# EAGLE design remote_switch (EAGLE 6.4)
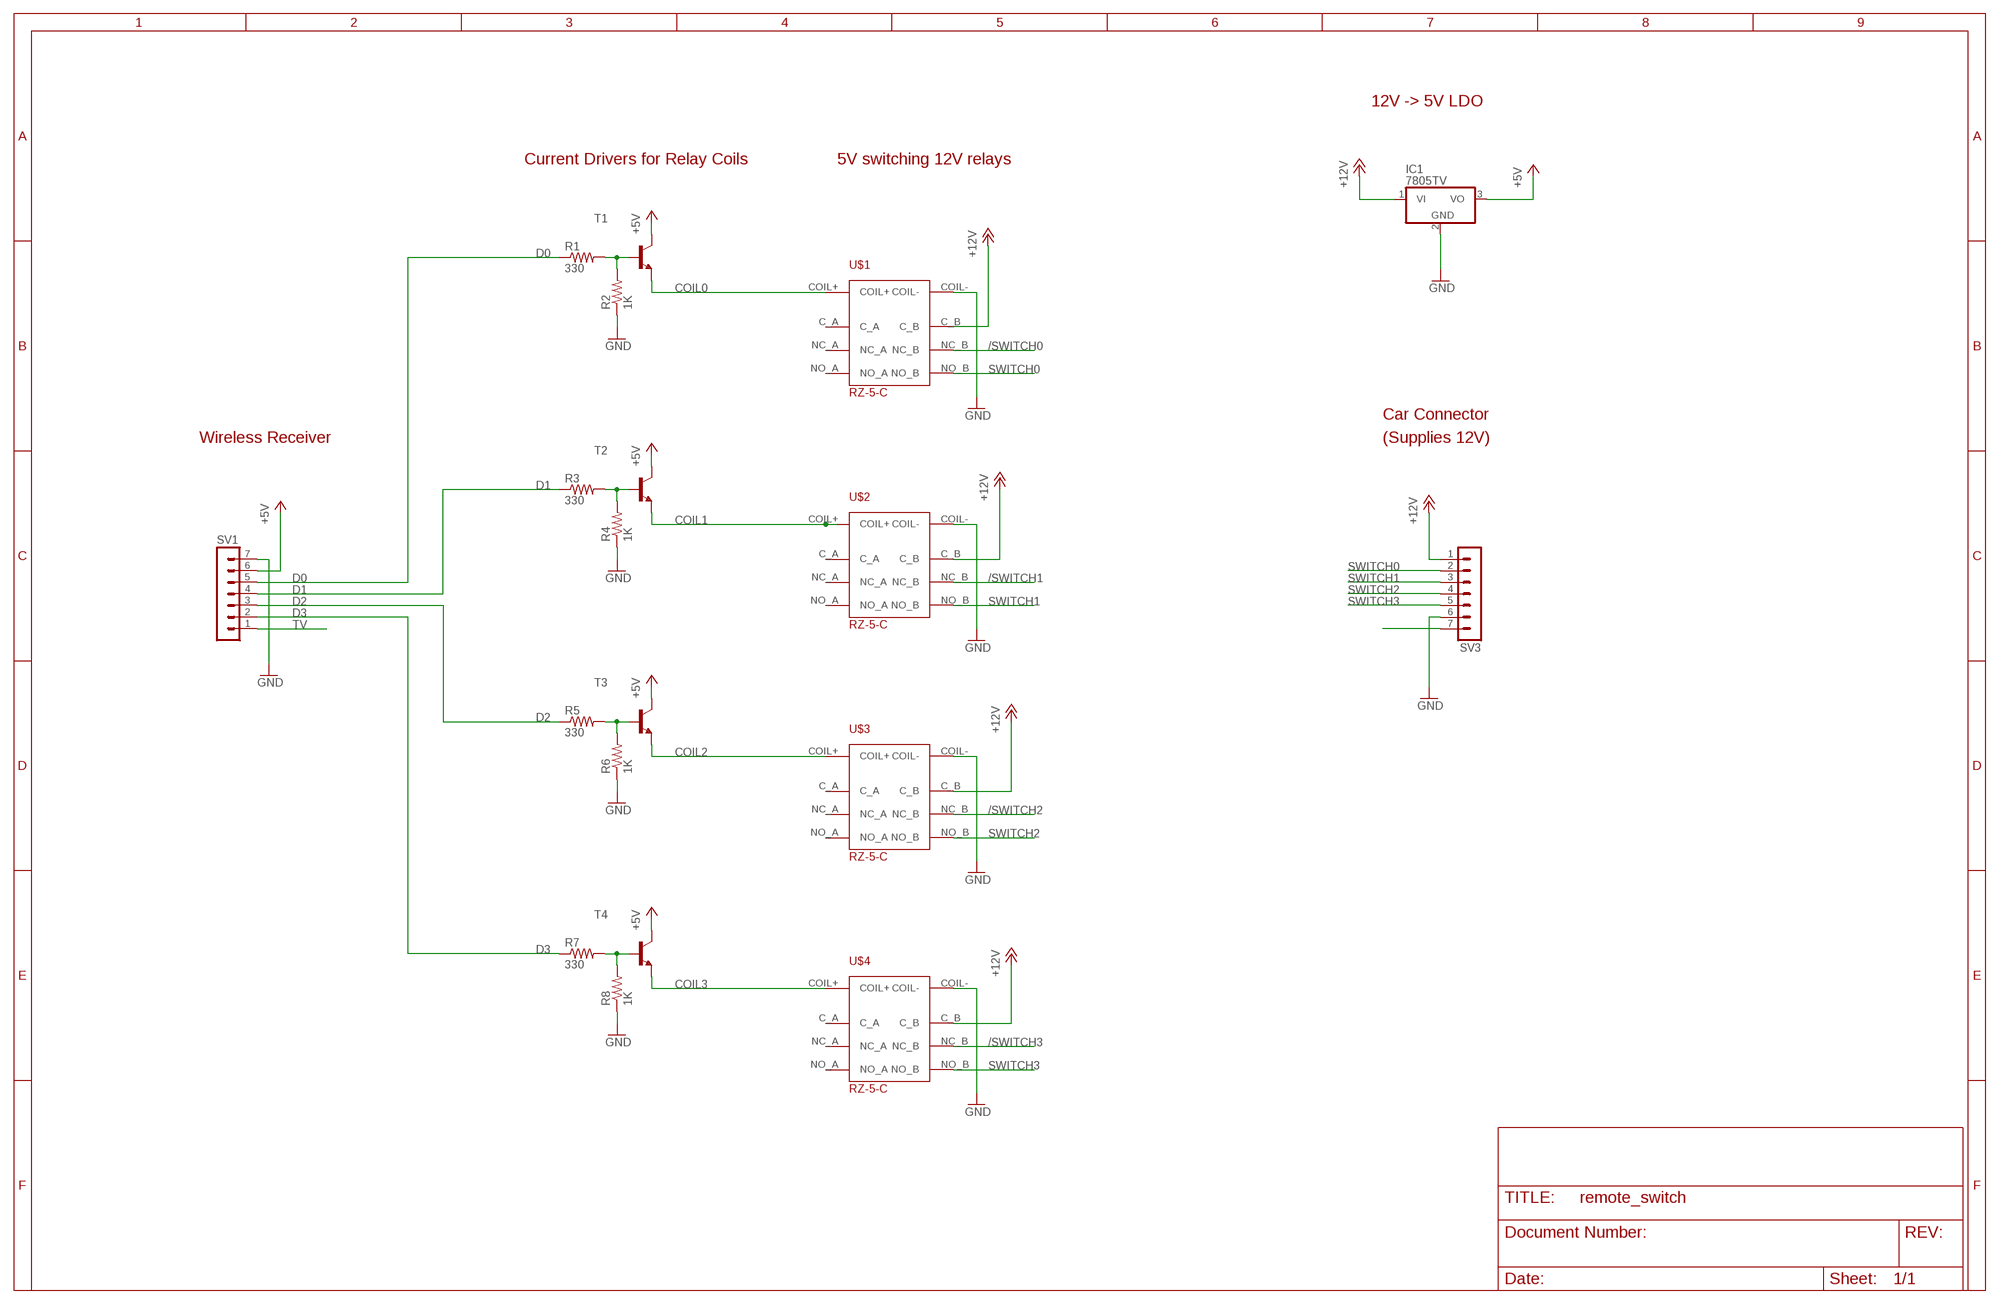
[diagram p0: schematic, sheet 1]

## Parts
IC1  7805TV  [TO220V]
R1  330  R-US_0613/5V  [P0613V]
R2  1K  R-US_0613/5V  [P0613V]
R3  330  R-US_0613/5V  [P0613V]
R4  1K  R-US_0613/5V  [P0613V]
R5  330  R-US_0613/5V  [P0613V]
R6  1K  R-US_0613/5V  [P0613V]
R7  330  R-US_0613/5V  [P0613V]
R8  1K  R-US_0613/5V  [P0613V]
SV1  MA07-1  [MA07-1]
SV3  MA07-1  [MA07-1]
T1  MPS2222A-NPN-TO92-CBE  [TO92-CBE]
T2  MPS2222A-NPN-TO92-CBE  [TO92-CBE]
T3  MPS2222A-NPN-TO92-CBE  [TO92-CBE]
T4  MPS2222A-NPN-TO92-CBE  [TO92-CBE]
U$1  RZ-5-C  [RZ-5-C]
U$2  RZ-5-C  [RZ-5-C]
U$3  RZ-5-C  [RZ-5-C]
U$4  RZ-5-C  [RZ-5-C]

## Nets
+5V: IC1.3(VO) SV1.6 T1.C T2.C T3.C T4.C
+12V: IC1.1(VI) SV3.1 U$1.C_B U$2.C_B U$3.C_B U$4.C_B
/SWITCH0: U$1.NC_B
/SWITCH1: U$2.NC_B
/SWITCH2: U$3.NC_B
/SWITCH3: U$4.NC_B
COIL0: T1.E U$1.COIL+
COIL1: T2.E U$2.COIL+
COIL2: T3.E U$3.COIL+
COIL3: T4.E U$4.COIL+
D0: R1.1 SV1.5
D1: R3.1 SV1.4
D2: R5.1 SV1.3
D3: R7.1 SV1.2
GND: IC1.2(GND) R2.1 R4.1 R6.1 R8.1 SV1.7 SV3.6 U$1.COIL- U$2.COIL- U$3.COIL- U$4.COIL-
N$1: R1.2 R2.2 T1.B
N$2: R3.2 R4.2 T2.B
N$3: R5.2 R6.2 T3.B
N$4: R7.2 R8.2 T4.B
N$6: SV3.7
SWITCH0: SV3.2 U$1.NO_B
SWITCH1: SV3.3 U$2.NO_B
SWITCH2: SV3.4 U$3.NO_B
SWITCH3: SV3.5 U$4.NO_B
TV: SV1.1
Unconnected: U$1.C_A U$1.NC_A U$1.NO_A U$2.C_A U$2.NC_A U$2.NO_A U$3.C_A U$3.NC_A U$3.NO_A U$4.C_A U$4.NC_A U$4.NO_A

## Notes on the sheet
- 12V -> 5V LDO
- Current Drivers for Relay Coils | 5V switching 12V relays
- Car Connector
- Wireless Receiver | (Supplies 12V)

## Library data of the parts
IC1 = linear:78*: Positive VOLTAGE REGULATOR Source: http://cache.national.com/ds/LM/LM78L05.pdf http://www.fairchildsemi.com/ds/LM/LM7805.pdf
R1-R8 = rcl:R-US_: RESISTOR, American symbol
SV1 SV3 = con-lstb:MA07-1: PIN HEADER; OC_FARNELL: unknown; OC_NEWARK: unknown
T1-T4 = transistor:*-NPN-: NPN Transistror BF959 corrected 2008.03.06
U$1-U$4 = remote_switch:RZ-5-C

## Board
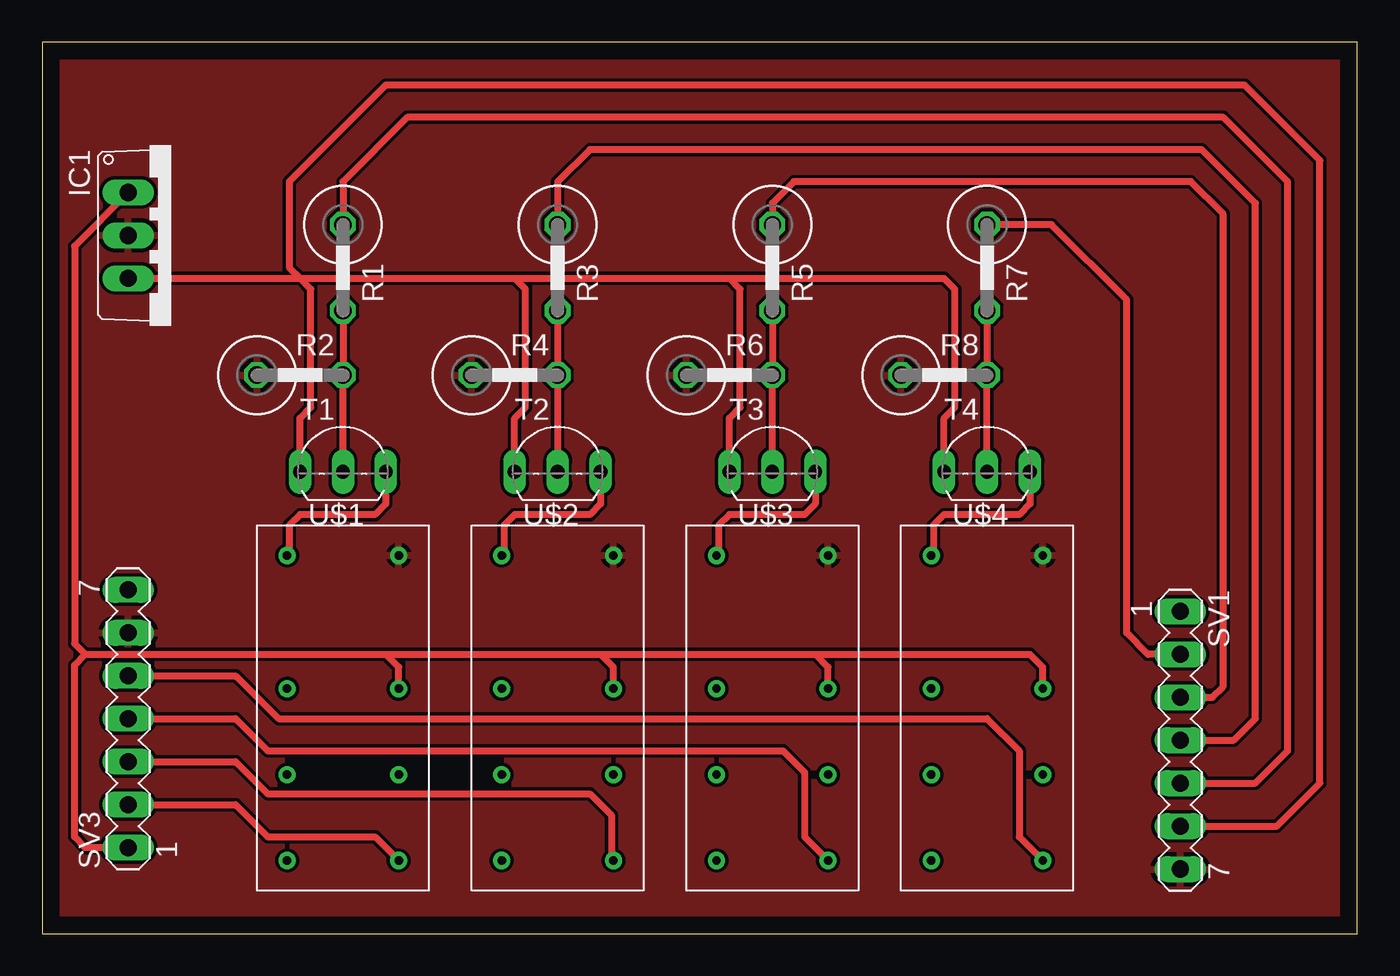
[diagram p1: board, top side]

Size 77.78 x 52.7 mm. Coordinates in mm from the lower left corner, seen from the top.
Outline: 0,0 77.78,0 77.78,52.7 0,52.7 0,0
Copper layers (1*16): Top 0.035mm / dielectric 1.5mm / Bottom 0.035mm
Design rules "default": minimum track width 10mil, minimum drill 24mil, track to track 8mil, track to pad 8mil, pad to pad 8mil, via to via 8mil, smd to smd 8mil, copper to edge 40mil, drill to drill 8mil, minimum pad ring 10mil, minimum via ring 8mil, stop-mask expansion 4mil, vias tented up to drill 0mil, thermal gap 10mil

### Footprints (pad centres in the part's own frame; a part is rotated, then mirrored left to right if it is on the bottom)
TO220V = drill 1.016 long: 1 -2.54,-2.54; 2 0,-2.54; 3 2.54,-2.54
P0613V = drill 1.016 octagon: 1 -2.54,0; 2 2.54,0
MA07-1 = drill 1.016 long: 1 -7.62,0; 2 -5.08,0; 3 -2.54,0; 4 0,0; 5 2.54,0; 6 5.08,0; 7 7.62,0
TO92-CBE = drill 0.813 long: B 0,0; C -2.54,0; E 2.54,0
RZ-5-C = drill 0.5: C_A 1.778,11.938; C_B 8.382,11.938; COIL+ 1.778,19.812; COIL- 8.382,19.812; NC_A 1.778,6.858; NC_B 8.382,6.858; NO_A 1.778,1.778; NO_B 8.382,1.778

### Placement (x,y rotation side)
IC1  7.62,41.27 270 top
R1  17.78,39.37 270 top
R2  15.24,33.02 0 top
R3  30.48,39.37 270 top
R4  27.94,33.02 0 top
R5  43.18,39.37 270 top
R6  40.64,33.02 0 top
R7  55.88,39.37 270 top
R8  53.34,33.02 0 top
SV1  67.31,11.43 270 top
SV3  5.08,12.7 90 top
T1  17.78,27.3 0 top
T2  30.48,27.3 0 top
T3  43.18,27.3 0 top
T4  55.88,27.3 0 top
U$1  12.7,2.54 0 top
U$2  25.4,2.54 0 top
U$3  38.1,2.54 0 top
U$4  50.8,2.54 0 top

### Tracks (layer width: path | path; a pad name or v marks a point on that pad's centre or on a via)
+5V
  Top 0.406: IC1.3 15.24,38.73 | 15.24,38.73 27.94,38.73 | 27.94,38.73 40.64,38.73 | 40.64,38.73 53.34,38.73 53.98,38.1 53.98,31.11 53.34,30.48 T4.C | T3.C 40.64,30.48 41.27,31.11 41.27,38.1 40.64,38.73 | T2.C 27.94,30.48 28.57,31.11 28.57,38.1 27.94,38.73 | T1.C 15.24,30.48 15.88,31.11 15.88,38.1 15.24,38.73 | SV1.6 73.03,6.35 75.56,8.89 75.56,45.72 71.12,50.16 20.32,50.16 14.61,44.45 14.61,39.37 15.24,38.73
+12V
  Top 0.406: SV3.1 2.54,5.08 1.91,5.71 1.91,15.88 2.54,16.51 | 2.54,16.51 20.32,16.51 | 20.32,16.51 33.02,16.51 | 33.02,16.51 45.72,16.51 | 45.72,16.51 58.42,16.51 59.18,15.75 U$4.C_B | U$3.C_B 46.48,15.75 45.72,16.51 | U$2.C_B 33.78,15.75 33.02,16.51 | U$1.C_B 21.08,15.75 20.32,16.51 | 2.54,16.51 1.91,17.14 1.91,40.64 IC1.1
COIL0
  Top 0.406: T1.E 20.32,25.4 19.68,24.77 15.24,24.77 14.61,24.13 14.61,22.48 U$1.COIL+
COIL1
  Top 0.406: T2.E 33.02,25.4 32.38,24.77 27.94,24.77 27.3,24.13 27.3,22.48 U$2.COIL+
COIL2
  Top 0.406: T3.E 45.72,25.4 45.09,24.77 40.64,24.77 40.01,24.13 40.01,22.48 U$3.COIL+
COIL3
  Top 0.406: T4.E 58.42,25.4 57.78,24.77 53.34,24.77 52.7,24.13 52.7,22.48 U$4.COIL+
D0
  Top 0.406: SV1.5 71.75,8.89 73.66,10.79 73.66,44.45 69.85,48.26 21.59,48.26 17.78,44.45 R1.1
D1
  Top 0.406: SV1.4 70.48,11.43 71.75,12.7 71.75,43.18 68.58,46.35 32.38,46.35 30.48,44.45 R3.1
D2
  Top 0.406: SV1.3 69.22,13.97 69.85,14.61 69.85,42.55 67.94,44.45 44.45,44.45 43.18,43.18 R5.1
D3
  Top 0.406: SV1.2 65.41,16.51 64.14,17.78 64.14,37.47 59.69,41.91 R7.1
GND
  pour Top: 0,0 78.11,0 78.11,52.7 0,52.7
N$1
  Top 0.406: R1.2 R2.2 T1.B
N$2
  Top 0.406: R3.2 R4.2 T2.B
N$3
  Top 0.406: R5.2 R6.2 T3.B
N$4
  Top 0.406: R7.2 R8.2 T4.B
SWITCH0
  Top 0.406: SV3.2 11.43,7.62 13.34,5.71 19.68,5.71 U$1.NO_B
SWITCH1
  Top 0.406: SV3.3 11.43,10.16 13.34,8.26 32.38,8.26 33.66,6.99 33.66,4.45 U$2.NO_B
SWITCH2
  Top 0.406: SV3.4 11.43,12.7 13.34,10.79 43.81,10.79 45.09,9.53 45.09,5.71 U$3.NO_B
SWITCH3
  Top 0.406: SV3.5 11.43,15.24 13.97,12.7 55.88,12.7 57.78,10.79 57.78,5.71 U$4.NO_B